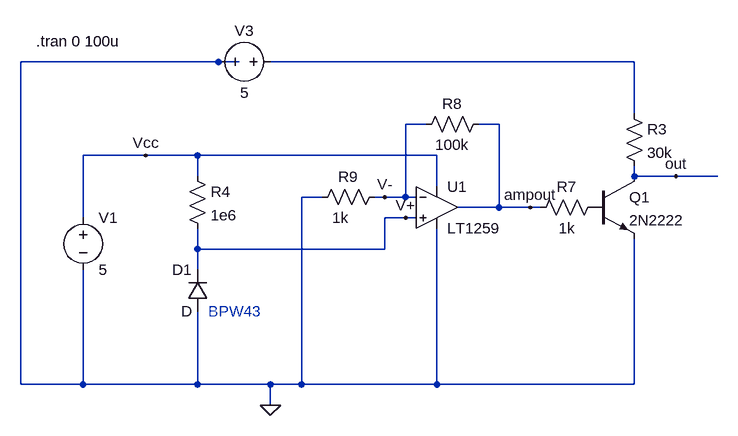
[diagram p0: schematic laserOpAmpAmp1259.asc]
laserOpAmpAmp1259.asc, the LTspice schematic file:
Version 4
SHEET 1 1028 680
WIRE 256 48 -48 48
WIRE 288 48 256 48
WIRE 896 48 336 48
WIRE 896 128 896 48
WIRE 576 144 544 144
WIRE 688 144 656 144
WIRE 144 192 48 192
WIRE 224 192 144 192
WIRE 592 192 224 192
WIRE 224 224 224 192
WIRE 896 224 896 208
WIRE 960 224 896 224
WIRE 1024 224 960 224
WIRE 592 240 592 192
WIRE 416 256 384 256
WIRE 512 256 496 256
WIRE 544 256 544 144
WIRE 544 256 512 256
WIRE 560 256 544 256
WIRE 688 272 688 144
WIRE 688 272 624 272
WIRE 736 272 688 272
WIRE 752 272 736 272
WIRE 48 288 48 192
WIRE 544 288 512 288
WIRE 560 288 544 288
WIRE 224 336 224 304
WIRE 512 336 512 288
WIRE 512 336 224 336
WIRE 224 368 224 336
WIRE -48 544 -48 48
WIRE 48 544 48 368
WIRE 48 544 -48 544
WIRE 224 544 224 432
WIRE 224 544 48 544
WIRE 336 544 224 544
WIRE 384 544 384 256
WIRE 384 544 336 544
WIRE 592 544 592 304
WIRE 592 544 384 544
WIRE 896 544 896 320
WIRE 896 544 592 544
WIRE 336 576 336 544
FLAG 336 576 0
FLAG 144 192 Vcc
FLAG 736 272 ampout
FLAG 512 256 V-
FLAG 960 224 out
FLAG 544 288 V+
SYMBOL npn 832 224 R0
SYMATTR InstName Q1
SYMATTR Value 2N2222
SYMBOL res 880 112 R0
SYMATTR InstName R3
SYMATTR Value 30k
SYMBOL res 208 208 R0
SYMATTR InstName R4
SYMATTR Value 1e6
SYMBOL voltage 48 272 R0
SYMATTR InstName V1
SYMATTR Value 5
SYMBOL voltage 352 48 R90
WINDOW 0 -32 56 VBottom 2
WINDOW 3 32 56 VTop 2
SYMATTR InstName V3
SYMATTR Value 5
SYMBOL Opamps/LT1259 592 208 R0
SYMATTR InstName U1
SYMBOL res 848 256 R90
WINDOW 0 0 56 VBottom 2
WINDOW 3 32 56 VTop 2
SYMATTR InstName R7
SYMATTR Value 1k
SYMBOL res 672 128 R90
WINDOW 0 0 56 VBottom 2
WINDOW 3 32 56 VTop 2
SYMATTR InstName R8
SYMATTR Value 100k
SYMBOL res 512 240 R90
WINDOW 0 0 56 VBottom 2
WINDOW 3 32 68 VTop 2
SYMATTR InstName R9
SYMATTR Value 1k
SYMBOL diode 240 432 R180
WINDOW 0 24 64 Left 2
WINDOW 3 24 0 Left 2
SYMATTR InstName D1
TEXT -24 16 Left 2 !.tran 0 100u
TEXT 240 432 Left 2 ;BPW43

The netlist it stands for:
* laserOpAmpAmp1259.asc
Q1 out P001 0 0 2N2222
R3 N001 out 30k
R4 Vcc V+ 1e6
V1 Vcc 0 5
V3 N001 0 5
XU1 V+ V- Vcc 0 ampout LT1259  ; pins In+ In- V+ V- OUT
R7 P001 ampout 1k
R8 ampout V- 100k
R9 V- 0 1k
D1 0 V+ D
.model D D
.lib standard.dio
.model NPN NPN
.model PNP PNP
.lib standard.bjt
.tran 0 100u
* BPW43
.backanno
.end